# EAGLE design poly-lamp-V1.0 (EAGLE 7.7.0)
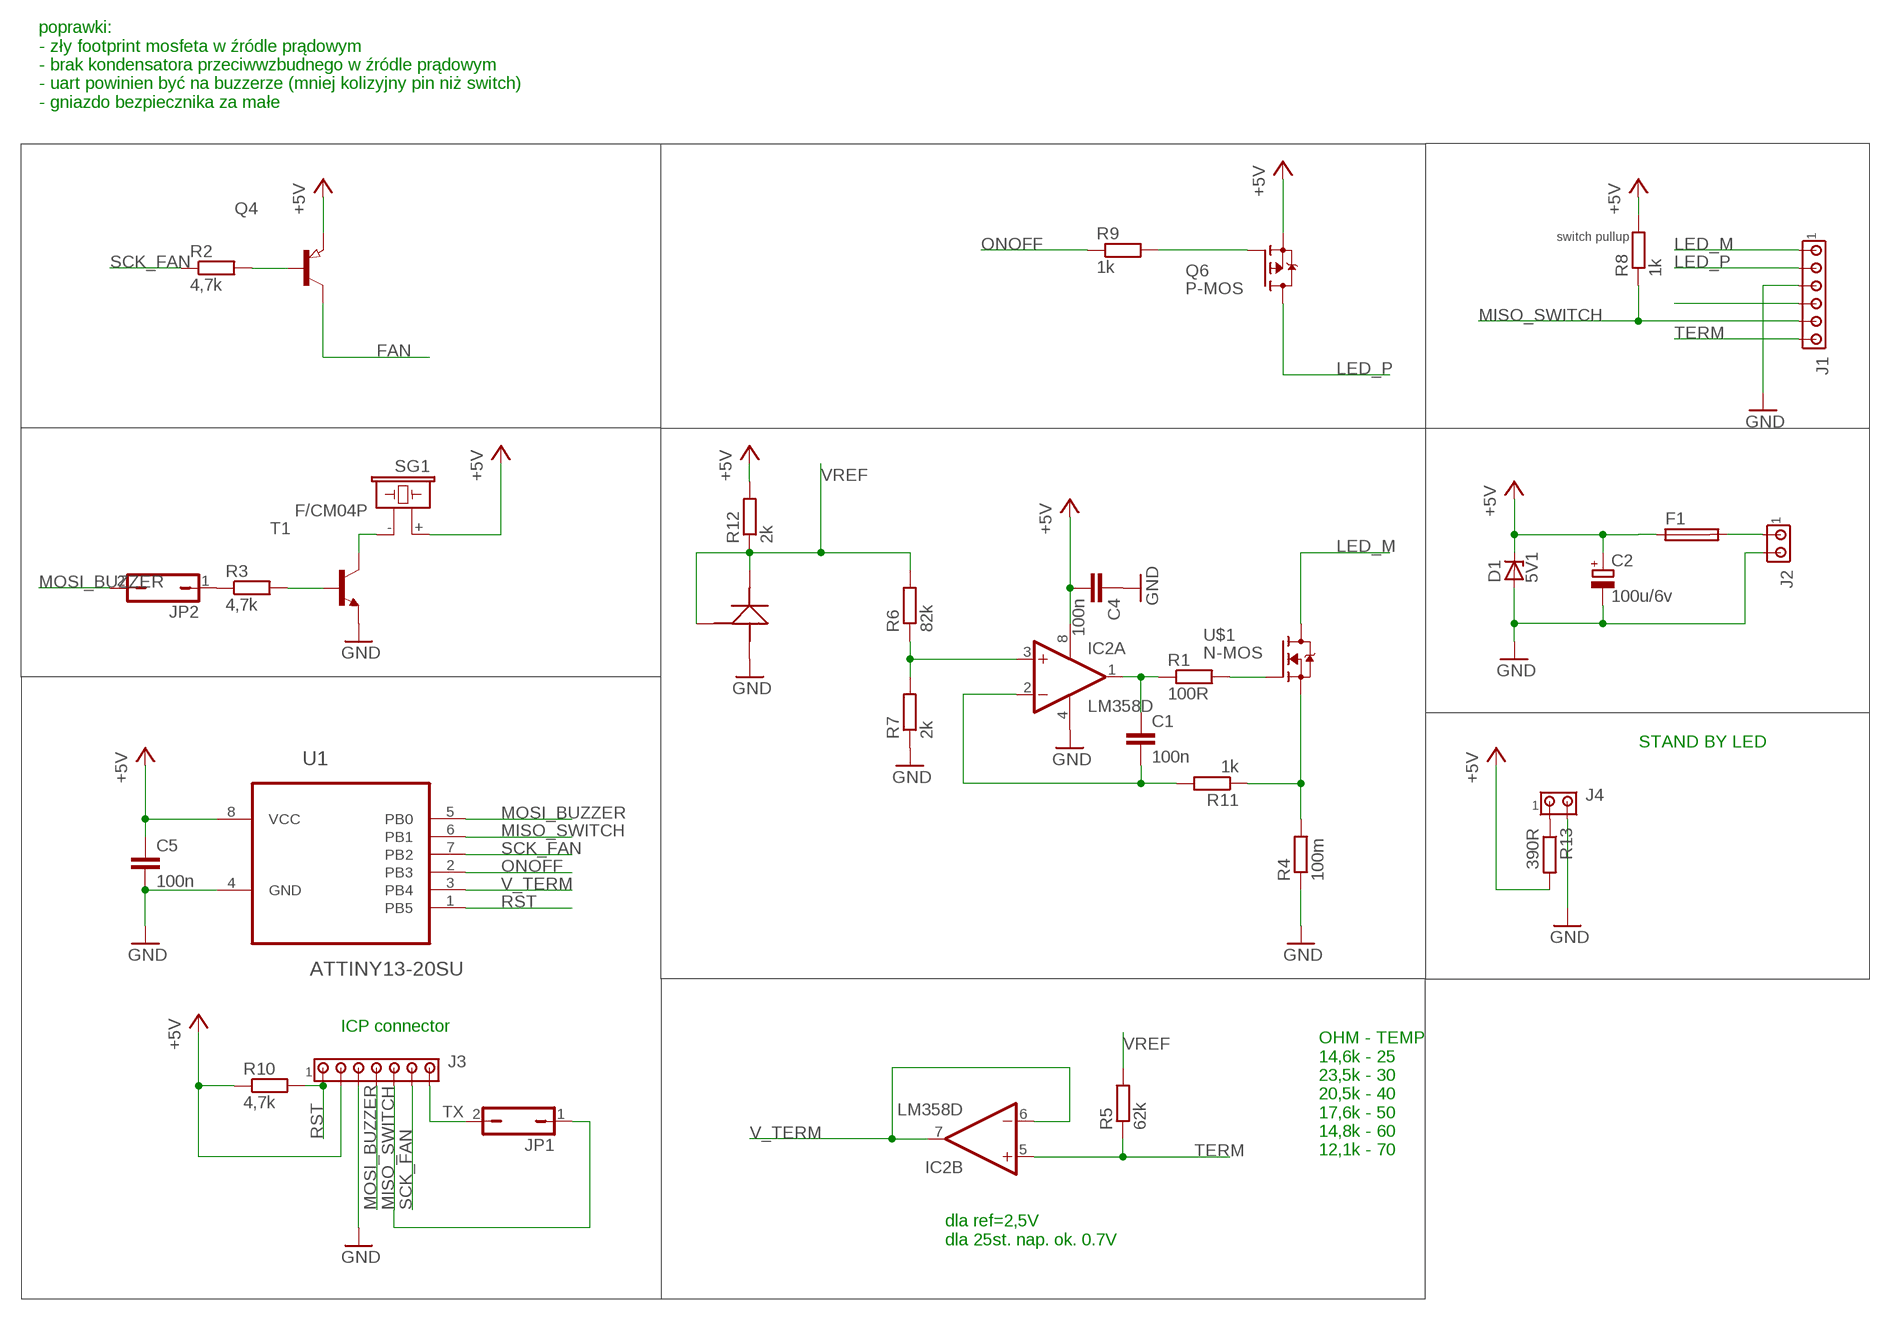
[diagram p0: schematic, sheet 1]

## Parts
C1  100n  C-EUC0805  [C0805]
C2  100u/6v  CPOL-EUE2.5-7  [E2,5-7]
C4  100n  C-EUC0805  [C0805]
C5  100n  C-EUC0805  [C0805]
D1  5V1  ZENER-DIODEDO35Z10  [DO35Z10]
F1  SH22,5  [SH22,5]
IC2  LM358D  [SO08]
J1  MTA06-100  [10X06MTA]
J2  MTA02-100  [10X02MTA]
J3  MTA07-100  [10X07MTA]
J4  MTA02-100  [10X02MTA]
JP1  JP1Q  [JP1]
JP2  JP1Q  [JP1]
Q4  PNP-TRANSISTOR_SOT23  [SOT23]
Q6  P-MOS  FDD4141TO252  [TO252]
R1  100R  R-EU_R0805  [R0805]
R2  4,7k  R-EU_R0805  [R0805]
R3  4,7k  R-EU_R0805  [R0805]
R4  100m  R-EU_R0805  [R0805]
R5  62k  R-EU_R0805  [R0805]
R6  82k  R-EU_R0805  [R0805]
R7  2k  R-EU_R0805  [R0805]
R8  1k  R-EU_R0805  [R0805]
R9  1k  R-EU_R0805  [R0805]
R10  4,7k  R-EU_R0805  [R0805]
R11  1k  R-EU_R0805  [R0805]
R12  2k  R-EU_R0805  [R0805]
R13  390R  R-EU_R0805  [R0805]
SG1  F/CM04P  [F/CM04P]
T1  BC817-16-NPN-SOT23-BEC  [SOT23-BEC]
U1  ATTINY13-20SU  [SOIC127P798X216-8N]
U$1  N-MOS  [TO252]
U$2  TL431  [SOT23-BEC]

## Nets
+5V: C2.+ C4.2 C5.1 D1.C F1.1 IC2.8(P:V+) J3.2 Q4.2(E) Q6.2(S) R8.2 R10.1 R12.2 R13.2 SG1.+ U1.8(VCC)
FAN: J1.4 Q4.3(C)
GND: C2.- C4.1 C5.2 D1.A IC2.4(P:V-) J1.3 J2.2 J3.3 J4.2 R4.1 R7.1 T1.E U1.4(GND) U$2.C(A)
LED_M: J1.1 U$1.3(D)
LED_P: J1.2 Q6.3(D)
MISO_SWITCH: J1.5 J3.5 JP1.1 R8.1 U1.6(PB1)
MOSI_BUZZER: J3.4 JP2.2 U1.5(PB0)
N$1: C1.1 IC2.1(A:OUT) R1.1
N$2: R1.2 U$1.1(G)
N$3: R3.2 T1.B
N$4: SG1.- T1.C
N$5: Q4.1(B) R2.2
N$6: IC2.3(A:+IN) R6.1 R7.2
N$7: C1.2 IC2.2(A:-IN) R11.2
N$8: Q6.1(G) R9.2
N$9: F1.2 J2.1
N$10: JP2.1 R3.1
N$11: J4.1 R13.1
N$12: R4.2 R11.1 U$1.2(S)
ONOFF: R9.1 U1.2(PB3)
RST: J3.1 R10.2 U1.1(PB5)
SCK_FAN: J3.6 R2.1 U1.7(PB2)
TERM: IC2.5(B:+IN) J1.6 R5.1
TX: J3.7 JP1.2
V_TERM: IC2.6(B:-IN) IC2.7(B:OUT) U1.3(PB4)
VREF: R5.2 R6.2 R12.1 U$2.B(K) U$2.E(R)

## Notes on the sheet
- poprawki:
  - zły footprint mosfeta w źródle prądowym
  - brak kondensatora przeciwwzbudnego w źródle prądowym
  - uart powinien być na buzzerze (mniej kolizyjny pin niż switch)
  - gniazdo bezpiecznika za małe
- switch pullup
- STAND BY LED
- ICP connector
- OHM - TEMP
  14,6k - 25
  23,5k - 30
  20,5k - 40
  17,6k - 50
  14,8k - 60
  12,1k - 70
- dla ref=2,5V
  dla 25st. nap. ok. 0.7V

## Library data of the parts
C1 C4 C5 = rcl:C-EU: CAPACITOR, European symbol
C2 = resistor:CPOL-EU: POLARIZED CAPACITOR, European symbol
D1 = diode:ZENER-DIODE: Z-Diode
F1 = fuse:SH22,5: FUSE HOLDER grid 22,5 mm, OGN0031 8201, Schurter (Buerklin); MF: SCHURTER; MPN: 0031.8201; OC_FARNELL: 1162740; OC_NEWARK: 96F8317
IC2 = linear:LM358: OP AMP also LM158; LM258; LM2904 Source: http://cache.national.com/ds/LM/LM158.pdf
J1 = con-amp:MTA06-100: AMP connector Connection corrected 2014-09-19
J2 J4 = con-amp:MTA02-100: AMP connector
J3 = con-amp:MTA07-100: AMP connector
JP1 JP2 = jumper:JP1Q: JUMPER
Q4 = semicon-smd-ipc:PNP-TRANSISTOR_: PNP TRANSISTOR
Q6 = transistor-fet:FDD4141: P-Channel PowerTrench® MOSFET Source: FDD4141.pdf
R1 R4 R6-R13 = rcl:R-EU_: RESISTOR, European symbol
R2 R3 R5 = resistor:R-EU_: RESISTOR, European symbol
SG1 = buzzer:F/CM04P: BUZZER Source: Buerklin; OC_FARNELL: unknown; OC_NEWARK: unknown
T1 = transistor:*-NPN-: NPN Transistror BF959 corrected 2008.03.06
U1 = Atmel_By_element14_Batch_1-00:ATTINY13-20SU: 8-bit Microcontroller with In-System Programmable Flash; MPN: ATTINY13-20SU; OC_FARNELL: 9171568; OC_NEWARK: 96K6522; PACKAGE: SOIC-8; SUPPLIER: Atmel
U$1 = transistor-fet:N-MOS
U$2 = ref-packages:TL431

## Net classes
0 default: clearance 0.7 mm

## Board
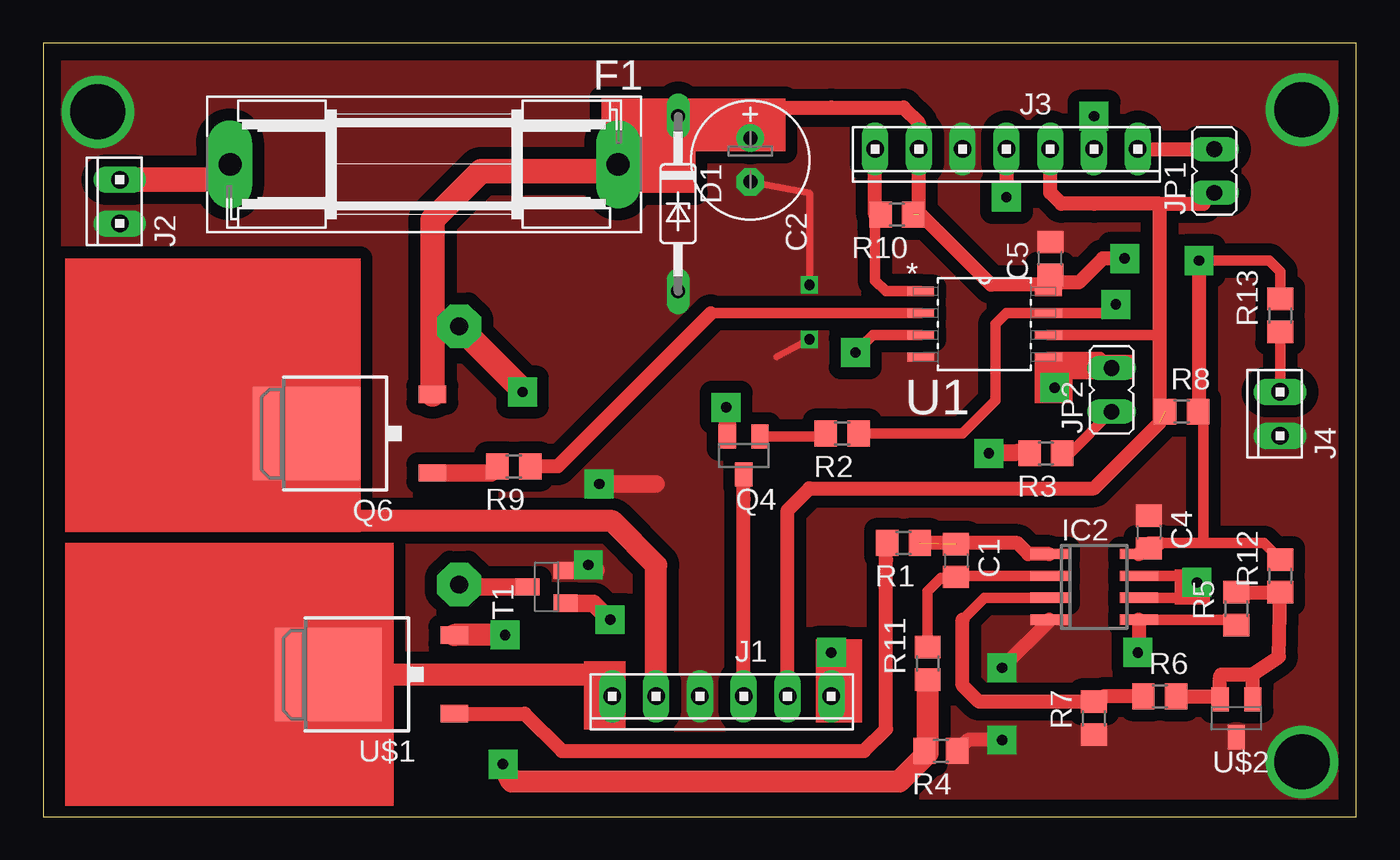
[diagram p1: board, top side]
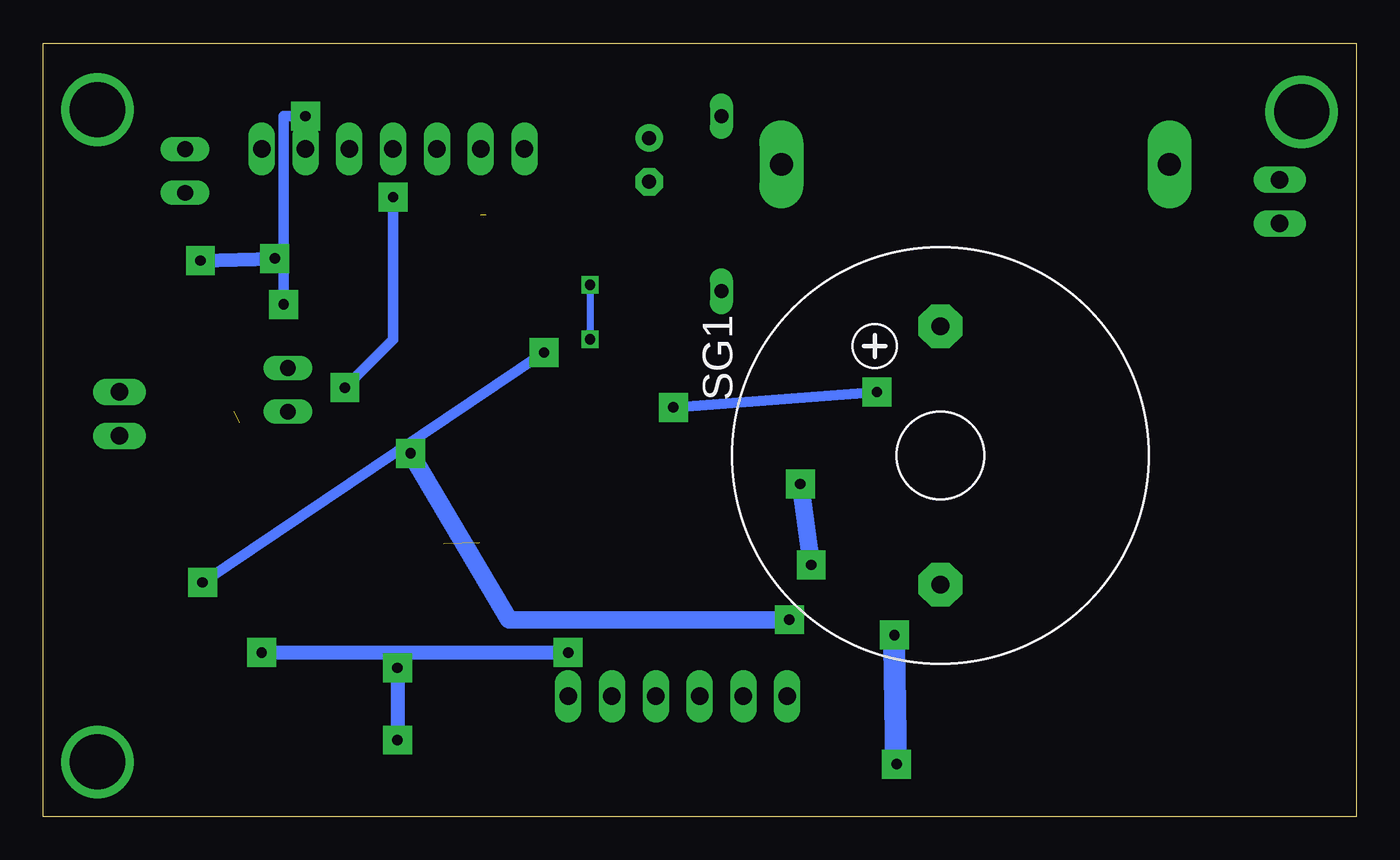
[diagram p2: board, bottom side, seen from below]

Size 76.18 x 44.88 mm. Coordinates in mm from the lower left corner, seen from the top.
Outline: 0,0 76.18,0 76.18,44.88 0,44.88 0,0
Copper layers (1*16): Top 0.035mm / dielectric 1.5mm / Bottom 0.035mm
Design rules "default": minimum track width 10mil, minimum drill 24mil, track to track 8mil, track to pad 8mil, pad to pad 8mil, via to via 8mil, smd to smd 8mil, copper to edge 40mil, drill to drill 8mil, minimum pad ring 10mil, minimum via ring 8mil, stop-mask expansion 4mil, vias tented up to drill 0mil, thermal gap 10mil

### Footprints (pad centres in the part's own frame; a part is rotated, then mirrored left to right if it is on the bottom)
C0805 = smd 1.3 x 1.5: 1 -0.95,0; 2 0.95,0
E2,5-7 = drill 0.813 pad 1.6: + -1.27,0 | drill 0.813 pad 1.6 octagon: - 1.27,0
DO35Z10 = drill 0.813 long: A 5.08,0; C -5.08,0
SH22,5 = drill 1.321 pad 2.54 long: 1 -11.252,0; 2 11.252,0
SO08 = smd 0.6 x 2.2: 1 -1.905,-2.6; 2 -0.635,-2.6; 3 0.635,-2.6; 4 1.905,-2.6; 5 1.905,2.6; 6 0.635,2.6; 7 -0.635,2.6; 8 -1.905,2.6
10X06MTA = drill 1.016 long: 1 6.35,0; 2 3.81,0; 3 1.27,0; 4 -1.27,0; 5 -3.81,0; 6 -6.35,0
10X02MTA = drill 1.016 long: 1 1.27,0; 2 -1.27,0
10X07MTA = drill 1.016 long: 1 7.62,0; 2 5.08,0; 3 2.54,0; 4 0,0; 5 -2.54,0; 6 -5.08,0; 7 -7.62,0
JP1 = drill 0.914 long: 1 0,-1.27; 2 0,1.27
SOT23 = smd 1 x 1.4: 1 -0.95,-1.1; 2 0.95,-1.1; 3 0,1.1
TO252 = smd 1 x 1.6: 1 -2.28,-4.8; 2 2.28,-4.8 | smd 5.4 x 6.2: 3 0,2.5
R0805 = smd 1.3 x 1.5: 1 -0.95,0; 2 0.95,0
F/CM04P = drill 1.016 pad 2.54 octagon: + 7.493,0; - -7.493,0
SOT23-BEC = smd 1 x 1.4: B -0.95,-1.1; C 0,1.1; E 0.95,-1.1
SOIC127P798X216-8N = smd 1.549 x 0.533: 1 -3.708,1.905; 2 -3.708,0.635; 3 -3.708,-0.635; 4 -3.708,-1.905; 5 3.708,-1.905; 6 3.708,-0.635; 7 3.708,0.635; 8 3.708,1.905

### Placement (x,y rotation side)
C1  52.96,14.86 270 top
C2  41.02,38.1 270 top
C4  64.13,16.51 270 top
C5  58.42,32.38 90 top
D1  36.83,35.56 270 top
F1  22.1,37.85 180 top
IC2  60.96,13.33 270 top
J1  39.37,6.99 180 top
J2  4.45,35.69 90 top
J3  55.88,38.73 180 top
J4  71.75,23.37 90 top
JP1  67.94,37.47 0 top
JP2  61.98,24.77 0 top
Q4  40.64,20.96 180 top
Q6  17.78,22.23 90 top
R1  49.91,15.88 180 top
R2  46.36,22.23 180 top
R3  58.17,21.08 180 top
R4  52.07,3.81 180 top
R5  69.22,12.06 90 top
R6  64.77,6.99 0 top
R7  60.96,5.71 90 top
R8  66.04,23.5 0 top
R9  27.3,20.32 180 top
R10  49.53,34.93 180 top
R11  51.31,8.89 90 top
R12  71.75,13.97 90 top
R13  71.75,29.08 90 top
SG1  24.13,20.96 90 bottom
T1  29.21,13.33 90 top
U1  54.61,28.58 0 top
U$1  19.05,8.25 90 top
U$2  69.22,5.71 180 top

### Tracks (layer width: path | path; a pad name or v marks a point on that pad's centre or on a via)
+5V  (via drill 0.6 pad 1.68)  (1 unrouted)
  Top 0.406: 50.8,35.05 50.8,34.93 | 58.86,30.86 58.32,30.86 U1.8
  Top 0.61: C4.2 64.45,15.56 64.77,15.88 67.31,15.88 | 67.31,15.88 70.8,15.88 R12.2 | C5.1 58.86,30.86 | R8.2 67.31,23.18 67.31,15.88 | 22.96,28.45 22.58,28.83 | v67.06,32.26 71.12,32.26 71.75,31.62 R13.2
  Top 0.813: IC2.8 64.19,15.88 64.77,15.88 | C2.+ 42.8,41.15 45.72,41.15 49.91,41.15 50.8,40.26 J3.2 50.8,35.05 54.99,30.86 58.86,30.86 58.99,30.99 60.07,30.99 61.47,32.38 v62.74,32.38 | R8.2 67.06,23.5 v67.06,32.26
  Top 1.016: Q4.2 39.69,23.68 v39.62,23.75 | v27.81,24.64 27.81,24.77
  Top 1.422: 27.81,24.77 SG1.+ 22.96,28.45 | Q6.2 22.58,28.83 22.58,34.65 25.4,37.47 32.97,37.47 F1.1 33.35,38.68 35.05,40.39 36.58,40.39 D1.C 38.1,39.37 C2.+
  Bottom 0.61: v39.62,23.75 v27.81,24.64
  Bottom 0.813: v67.06,32.26 v62.74,32.38
FAN
  Top 0.813: J1.4 40.64,18.42 Q4.3
GND  (via drill 0.6, 0.6 pad 1.68, 3.2 pad 1.68)
  Top 0.406: C2.- 44.45,36.2 v44.45,30.86 | v44.45,27.69 42.55,26.67
  Top 0.813: IC2.4 58.36,11.37 v55.63,8.64 | v55.63,4.45 53.66,4.45 R4.1
  Top 1.016: T1.E 32.06,14.29 v31.62,14.6 | v32.26,19.3 35.56,19.3
  Bottom 0.406: v44.45,30.86 v44.45,27.69
  Bottom 0.813: v55.63,8.64 v55.63,4.45
  Bottom 1.016: v31.62,14.6 v32.26,19.3
  other vias: 73.03,3.17 73.03,41.02 3.18,40.89
  pour Top (no thermals): 0,-0.64 76.2,-0.64 76.2,45.09 0,45.09
LED_M
  Top 1.27: U$1.3 31.75,8.25 J1.1
LED_P
  Top 1.27: J1.2 35.56,14.6 33.02,17.14 15.24,17.14 15.24,20.96 13.97,22.23 15.24,22.23 Q6.3
MISO_SWITCH  (1 unrouted)
  Top 0.61: U1.6 64.77,27.94 64.77,28.58 | 67.31,35.56 JP1.1
  Top 0.813: 64.77,35.56 64.77,31.75 64.77,28.58 64.77,27.94 64.77,22.86 62.23,20.32 60.96,19.05 44.45,19.05 43.18,17.78 J1.5 | 64.77,35.56 60.96,35.56 59.05,35.56 58.42,36.2 J3.5 | 64.77,35.56 67.31,35.56
MOSI_BUZZER  (via drill 0.6 pad 1.68)
  Top 0.61: JP2.2 61.34,26.67 U1.5 58.67,26.31 v58.67,24.89
  Top 0.813: J3.4 v55.88,35.94
  Bottom 0.61: v55.88,35.94 55.88,27.69 v58.67,24.89
N$1  (1 unrouted)
  Top 0.813: IC2.1 57.15,15.24 56.52,15.88 R1.1
N$2
  Top 0.813: U$1.1 27.93,5.98 30.1,3.81 47.62,3.81 48.89,5.08 48.89,14.92 R1.2
N$3  (via drill 0.6 pad 1.68)
  Top 1.016: T1.B 31.94,12.38 v32.89,11.43 | v54.86,21.08 57.28,21.15 R3.2
  Bottom 1.016: v32.89,11.43 49.15,11.43 v54.86,21.08
N$4
  Top 1.016: T1.C 24.26,13.33 SG1.-
N$5
  Top 0.61: R2.2 45.23,22.05 Q4.1
N$6
  Top 0.61: IC2.3 54.61,12.7 53.98,12.06 53.34,11.43
  Top 0.813: R6.1 61.53,6.99 R7.2 54.3,6.67 53.34,7.62 53.34,11.43
N$7
  Top 0.61: IC2.2 52.96,13.97 C1.2 52.89,13.84 52.07,13.84 51.31,13.08 R11.2
N$8
  Top 0.813: 25.98,19.95 R9.2
  Top 1.016: Q6.1 25.98,19.95
N$9
  Top 1.422: J2.1 9.96,36.96 F1.2
N$10
  Top 0.61: R3.1 59.56,21.08 JP2.1
N$11
  Top 0.61: R13.1 J4.1
N$12  (via drill 0.6 pad 1.68)
  Top 0.61: 51.44,4.76 51.31,4.76 R11.1
  Top 0.813: 51.44,4.76 R4.2
  Top 1.27: R11.1 51.31,3.68 49.66,2.03 27.18,2.03 v26.67,3.05 | v26.8,10.54 U$1.2
  Bottom 1.27: v26.67,3.05 26.8,9.91 v26.8,10.54
ONOFF
  Top 0.61: U1.2 38.73,29.21
  Top 0.813: 38.73,29.21 29.85,20.32 R9.1
RST
  Top 0.406: R10.2 48.26,34.93
  Top 0.61: U1.1 48.89,30.48 48.26,31.12 48.26,34.93
  Top 0.813: 48.26,34.93 J3.1
SCK_FAN  (via drill 0.6 pad 1.68)
  Top 0.61: v62.23,29.72 62.23,29.85 61.59,29.21 U1.7 55.88,29.21 55.25,28.58 55.25,24.13 53.34,22.23 R2.1 | v60.96,40.64 J3.6
  Bottom 0.61: v62.23,29.72 62.23,40.64 v60.96,40.64
TERM  (via drill 0.6 pad 1.68)
  Top 0.61: IC2.5 68.9,11.43 R5.1
  Top 0.813: IC2.5 63.56,9.58 v63.5,9.53 | v45.72,9.53 J1.6
  Bottom 0.813: v63.5,9.53 v45.72,9.53
TX
  Top 0.813: J3.7 JP1.2
V_TERM  (via drill 0.6 pad 1.68)
  Top 0.61: IC2.6 66.04,12.7 66.04,13.33 66.04,13.46 | 66.04,13.46 66.04,13.59 | 66.04,13.59 66.04,13.97 64.13,13.97 IC2.7 | U1.3 48.13,27.94 v47.12,26.92 | v66.93,13.59 66.04,13.59 | 66.04,13.59 66.04,13.46
  Bottom 0.61: v47.12,26.92 v66.93,13.59
VREF
  Top 0.61: R12.1 | 68.09,6.99 U$2.E
  Top 0.813: R5.2 R12.1 | U$2.B 70.16,8.25 | 70.16,8.25 71.69,9.28 R12.1 | U$2.E 68.27,7.94 68.33,8.25 70.16,8.25 | R6.2 68.09,6.99
(copper drawn outside any net)
  shapes: Top area x10